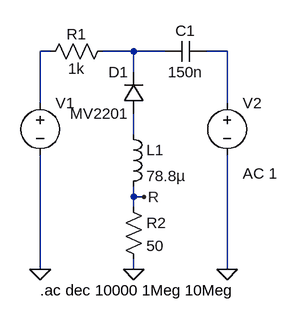
[diagram p0: schematic zad4_lista5.asc]
zad4_lista5.asc, the LTspice schematic file:
Version 4.1
SHEET 1 880 680
WIRE 80 64 64 64
WIRE 208 64 160 64
WIRE 256 64 208 64
WIRE 352 64 320 64
WIRE 208 96 208 64
WIRE 64 144 64 64
WIRE 352 144 352 64
WIRE 208 192 208 160
WIRE 208 288 208 272
WIRE 224 288 208 288
WIRE 208 304 208 288
WIRE 64 400 64 224
WIRE 208 400 208 384
WIRE 352 400 352 224
FLAG 64 400 0
FLAG 208 400 0
FLAG 352 400 0
FLAG 224 288 R
SYMBOL voltage 64 128 R0
WINDOW 3 24 44 Left 2
WINDOW 123 24 124 Left 2
WINDOW 39 0 0 Left 0
SYMATTR Value ""
SYMATTR InstName V1
SYMBOL res 176 48 R90
WINDOW 0 5 56 VBottom 2
WINDOW 3 27 56 VTop 2
SYMATTR InstName R1
SYMATTR Value 1k
SYMBOL diode 224 160 R180
WINDOW 0 24 64 Left 2
WINDOW 3 24 0 Left 2
SYMATTR InstName D1
SYMATTR Value MV2201
SYMBOL ind 192 176 R0
SYMATTR InstName L1
SYMATTR Value 78.8µ
SYMBOL res 192 288 R0
SYMATTR InstName R2
SYMATTR Value 50
SYMBOL cap 320 48 R90
WINDOW 0 0 32 VBottom 2
WINDOW 3 32 32 VTop 2
SYMATTR InstName C1
SYMATTR Value 150n
SYMBOL voltage 352 128 R0
WINDOW 123 24 124 Left 2
WINDOW 39 0 0 Left 0
SYMATTR Value2 AC 1
SYMATTR InstName V2
SYMATTR Value ""
TEXT 64 432 Left 2 !.ac dec 10000 1Meg 10Meg

The netlist it stands for:
* zad4_lista5.asc
V1 N001 0
R1 N002 N001 1k
D1 N004 N002 MV2201
L1 N004 R 78.8µ
R2 R 0 50
C1 N003 N002 150n
V2 N003 0 AC 1
.model D D
.lib standard.dio
.ac dec 10000 1Meg 10Meg
.backanno
.end